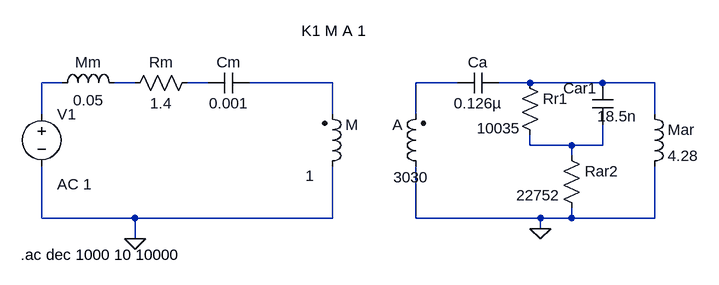
[diagram p0: schematic EA_EX7_PistaoCaixaSelada.asc]
EA_EX7_PistaoCaixaSelada.asc, the LTspice schematic file:
Version 4
SHEET 1 1048 680
WIRE -32 64 -64 64
WIRE 80 64 48 64
WIRE 192 64 160 64
WIRE 384 64 256 64
WIRE 576 64 512 64
WIRE 688 64 640 64
WIRE 800 64 688 64
WIRE 880 64 800 64
WIRE -64 112 -64 64
WIRE 384 112 384 64
WIRE 512 112 512 64
WIRE 880 112 880 64
WIRE 688 160 688 144
WIRE 752 160 688 160
WIRE 800 160 800 128
WIRE 800 160 752 160
WIRE 752 176 752 160
WIRE -64 272 -64 192
WIRE 80 272 -64 272
WIRE 384 272 384 192
WIRE 384 272 80 272
WIRE 512 272 512 192
WIRE 704 272 512 272
WIRE 752 272 752 256
WIRE 752 272 704 272
WIRE 880 272 880 192
WIRE 880 272 752 272
WIRE 704 288 704 272
WIRE 80 304 80 272
FLAG 80 304 0
FLAG 704 288 0
SYMBOL voltage -64 96 R0
WINDOW 123 24 124 Left 2
WINDOW 39 0 0 Left 0
SYMATTR Value2 AC 1
SYMATTR InstName V1
SYMATTR Value ""
SYMBOL ind -48 80 R270
WINDOW 0 32 56 VTop 2
WINDOW 3 5 56 VBottom 2
SYMATTR InstName Mm
SYMATTR Value 0.05
SYMBOL res 176 48 R90
WINDOW 0 0 56 VBottom 2
WINDOW 3 32 56 VTop 2
SYMATTR InstName Rm
SYMATTR Value 1.4
SYMBOL cap 256 48 R90
WINDOW 0 0 32 VBottom 2
WINDOW 3 32 32 VTop 2
SYMATTR InstName Cm
SYMATTR Value 0.001
SYMBOL ind2 368 208 M180
WINDOW 0 36 80 Left 2
WINDOW 3 -26 1 Left 2
SYMATTR InstName M
SYMATTR Value 1
SYMBOL ind2 528 208 R180
WINDOW 0 36 80 Left 2
WINDOW 3 -4 -1 Left 2
SYMATTR InstName A
SYMATTR Value 3030
SYMBOL cap 816 128 R180
WINDOW 0 24 56 Left 2
WINDOW 3 -36 13 Left 2
SYMATTR InstName Car1
SYMATTR Value 18.5n
SYMBOL ind 864 96 R0
SYMATTR InstName Mar
SYMATTR Value 4.28
SYMBOL res 672 48 R0
WINDOW 3 -66 86 Left 2
SYMATTR Value 10035
SYMATTR InstName Rr1
SYMBOL res 736 160 R0
WINDOW 3 -69 77 Left 2
SYMATTR Value 22752
SYMATTR InstName Rar2
SYMBOL cap 640 48 R90
WINDOW 0 0 32 VBottom 2
WINDOW 3 32 32 VTop 2
SYMATTR InstName Ca
SYMATTR Value 0.126µ
TEXT 336 -16 Left 2 !K1 M A 1
TEXT -96 328 Left 2 !.ac dec 1000 10 10000

The netlist it stands for:
* EA_EX7_PistaoCaixaSelada.asc
V1 N001 0 AC 1
L§Mm N001 N002 0.05
Rm N003 N002 1.4
Cm N004 N003 0.001
L§M 0 N004 1
L§A 0 N005 3030
Car1 N007 N006 18.5n
L§Mar N006 0 4.28
Rr1 N006 N007 10035
Rar2 N007 0 22752
Ca N006 N005 0.126µ
K1 M A 1
.ac dec 1000 10 10000
.backanno
.end